# EAGLE design 7Segment_Modul (EAGLE 4.16)
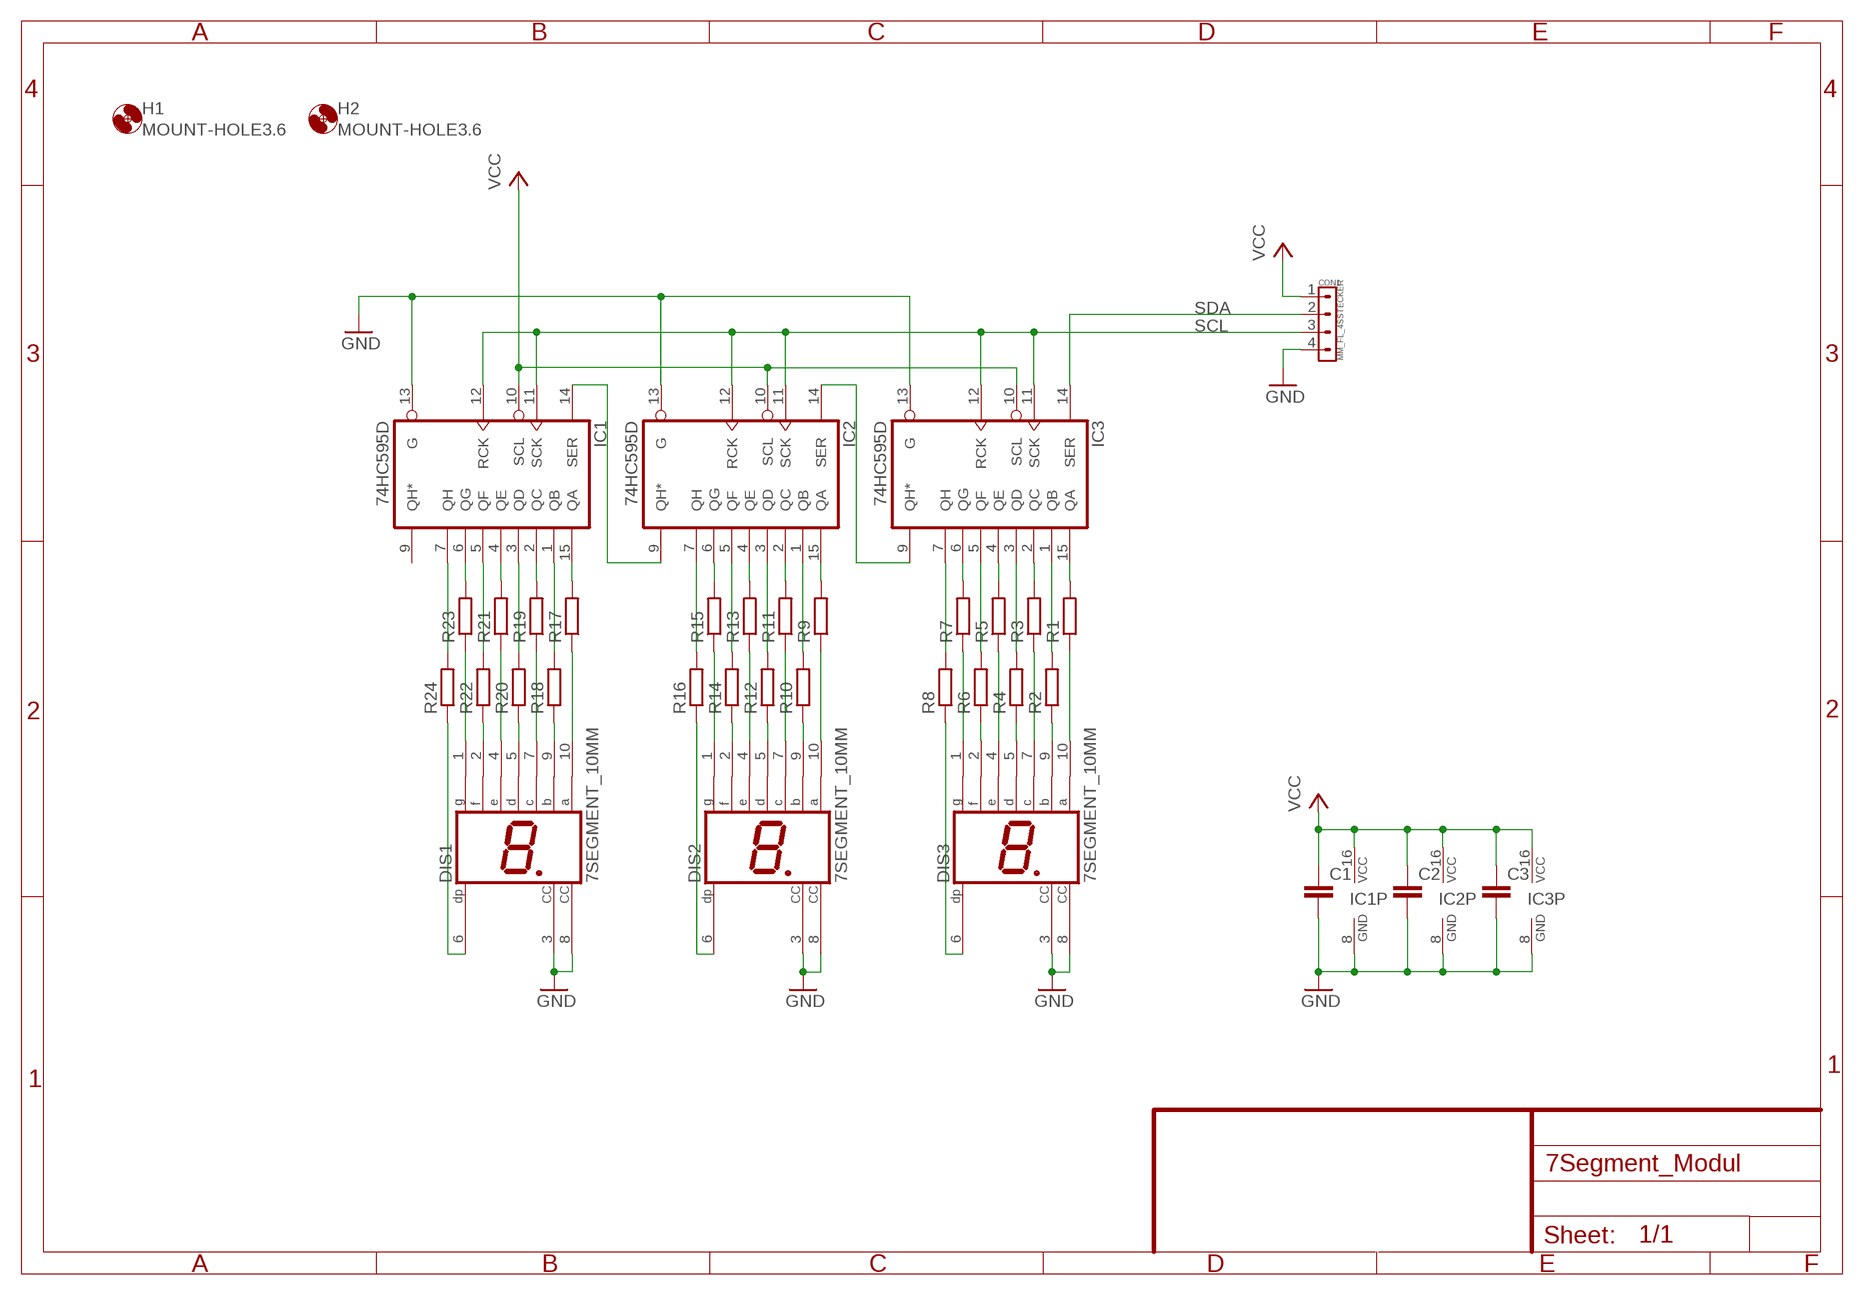
[diagram p0: schematic, sheet 1]

## Parts
C1  C-EUC0805  [C0805]
C2  C-EUC0805  [C0805]
C3  C-EUC0805  [C0805]
CON1  MM_FL_4SSTECKER  [MM_SL_4G]
DIS1  7SEGMENT_10MM  [HDSP-E]
DIS2  7SEGMENT_10MM  [HDSP-E]
DIS3  7SEGMENT_10MM  [HDSP-E]
H1  MOUNT-HOLE3.6  [3,6]
H2  MOUNT-HOLE3.6  [3,6]
IC1  74HC595D  [SO16]
IC2  74HC595D  [SO16]
IC3  74HC595D  [SO16]
R1  R-EU_R0603  [R0603]
R2  R-EU_R0603  [R0603]
R3  R-EU_R0603  [R0603]
R4  R-EU_R0603  [R0603]
R5  R-EU_R0603  [R0603]
R6  R-EU_R0603  [R0603]
R7  R-EU_R0603  [R0603]
R8  R-EU_R0603  [R0603]
R9  R-EU_R0603  [R0603]
R10  R-EU_R0603  [R0603]
R11  R-EU_R0603  [R0603]
R12  R-EU_R0603  [R0603]
R13  R-EU_R0603  [R0603]
R14  R-EU_R0603  [R0603]
R15  R-EU_R0603  [R0603]
R16  R-EU_R0603  [R0603]
R17  R-EU_R0603  [R0603]
R18  R-EU_R0603  [R0603]
R19  R-EU_R0603  [R0603]
R20  R-EU_R0603  [R0603]
R21  R-EU_R0603  [R0603]
R22  R-EU_R0603  [R0603]
R23  R-EU_R0603  [R0603]
R24  R-EU_R0603  [R0603]

## Nets
GND: C1.2 C2.2 C3.2 CON1.4 DIS1.3(CC) DIS1.8(CC) DIS2.3(CC) DIS2.8(CC) DIS3.3(CC) DIS3.8(CC) IC1.8(GND) IC1.13(G) IC2.8(GND) IC2.13(G) IC3.8(GND) IC3.13(G)
N$1: IC3.15(QA) R1.2
N$2: DIS3.10(A) R1.1
N$3: DIS3.9(B) R2.1
N$4: IC3.1(QB) R2.2
N$5: IC3.2(QC) R3.2
N$6: DIS3.7(C) R3.1
N$7: DIS3.5(D) R4.1
N$8: IC3.3(QD) R4.2
N$9: IC3.4(QE) R5.2
N$10: DIS3.4(E) R5.1
N$11: DIS3.2(F) R6.1
N$12: IC3.5(QF) R6.2
N$13: IC3.6(QG) R7.2
N$14: DIS3.1(G) R7.1
N$15: IC3.7(QH) R8.2
N$16: DIS3.6(DP) R8.1
N$17: DIS2.10(A) R9.1
N$18: IC2.15(QA) R9.2
N$19: IC2.1(QB) R10.2
N$20: DIS2.9(B) R10.1
N$21: DIS2.7(C) R11.1
N$22: IC2.2(QC) R11.2
N$23: DIS2.5(D) R12.1
N$24: IC2.3(QD) R12.2
N$25: IC2.4(QE) R13.2
N$26: DIS2.4(E) R13.1
N$27: DIS2.2(F) R14.1
N$28: IC2.5(QF) R14.2
N$29: IC2.6(QG) R15.2
N$30: DIS2.1(G) R15.1
N$31: IC2.7(QH) R16.2
N$32: DIS2.6(DP) R16.1
N$33: DIS1.10(A) R17.1
N$34: IC1.15(QA) R17.2
N$35: IC1.1(QB) R18.2
N$36: DIS1.9(B) R18.1
N$37: DIS1.7(C) R19.1
N$38: IC1.2(QC) R19.2
N$39: IC1.3(QD) R20.2
N$40: DIS1.5(D) R20.1
N$41: DIS1.4(E) R21.1
N$42: IC1.4(QE) R21.2
N$43: IC1.5(QF) R22.2
N$44: DIS1.2(F) R22.1
N$45: DIS1.1(G) R23.1
N$46: IC1.6(QG) R23.2
N$47: IC1.7(QH) R24.2
N$48: DIS1.6(DP) R24.1
N$49: IC2.14(SER) IC3.9(QH*)
N$50: IC1.14(SER) IC2.9(QH*)
SCL: CON1.3 IC1.11(SCK) IC1.12(RCK) IC2.11(SCK) IC2.12(RCK) IC3.11(SCK) IC3.12(RCK)
SDA: CON1.2 IC3.14(SER)
VCC: C1.1 C2.1 C3.1 CON1.1 IC1.10(SCL) IC1.16(VCC) IC2.10(SCL) IC2.16(VCC) IC3.10(SCL) IC3.16(VCC)
Unconnected: IC1.9(QH*)

## Library data of the parts
C1-C3 = rcl:C-EU: CAPACITOR, European symbol
CON1 = marcus:MM_FL_4S: Miniatru Print Stecker SMD 4 Kontakte Reichelt Bestellnummer: MM FL 4S Created by Marcus Knips 4/2013
DIS1-DIS3 = marcus:7SEGMENT_10MM: LED DISPLAY 1-character 7 segment, decimal point right Knigbright SA39-11, SA39-12, SC39-11, SC39-12 Device creaded by Marcus Knips 1/2012
H1 H2 = holes:MOUNT-HOLE: MOUNTING HOLE with drill center marker
IC1-IC3 = 74xx-eu:74*595: 8-bit SHIFT REGISTER, output latch
R1-R24 = rcl:R-EU_: RESISTOR, European symbol

## Board
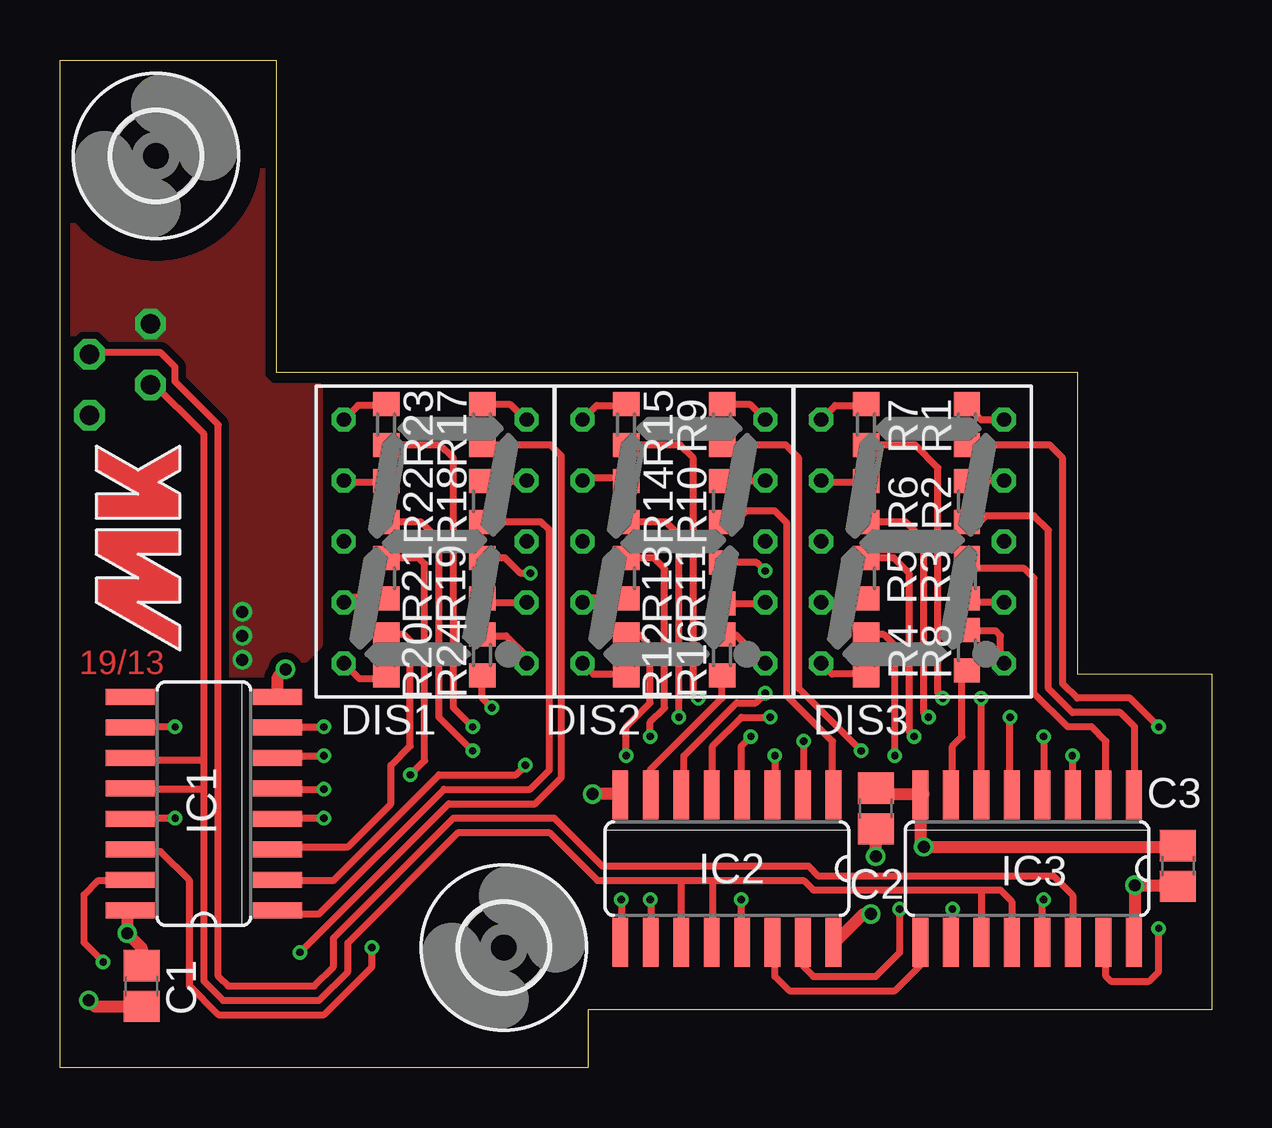
[diagram p1: board, top side]
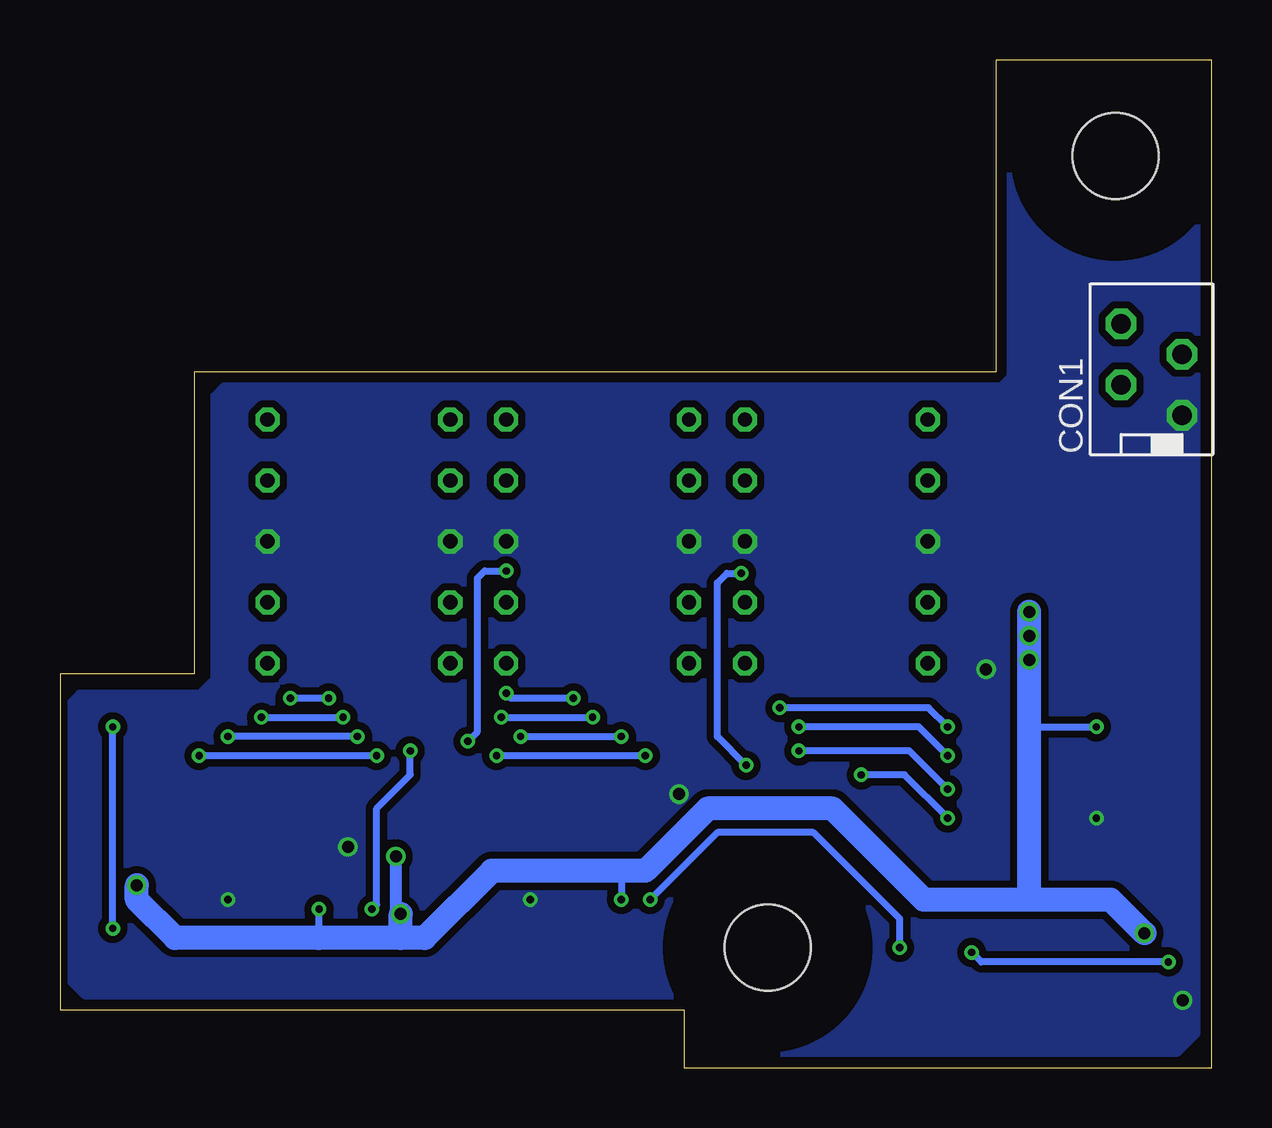
[diagram p2: board, bottom side, seen from below]

Size 48 x 42 mm. Coordinates in mm from the lower left corner, seen from the top.
Outline: 0,0 0,42 9,42 9,29 42.4,29 42.4,16.4 48,16.4 48,2.4 22,2.4 22,0 0,0
Copper layers (1*16): Top 0.035mm / dielectric 1.5mm / Bottom 0.035mm
Design rules "multi-cb_035um-cu": minimum track width 6mil, minimum drill 3mil, track to track 6mil, track to pad 6mil, pad to pad 6mil, via to via 6mil, smd to smd 6mil, copper to edge 10mil, drill to drill 8mil, minimum pad ring 8mil, minimum via ring 6mil, stop-mask expansion 3mil, vias tented up to drill 0mil, thermal gap 8mil

### Footprints (pad centres in the part's own frame; a part is rotated, then mirrored left to right if it is on the bottom)
C0805 = smd 1.3 x 1.5: 1 -0.85,0; 2 0.85,0
MM_SL_4G = drill 0.8 octagon: 1 0,1.27; 2 -1.27,-1.27; 3 -2.54,1.27; 4 -3.81,-1.27
HDSP-E = drill 0.6 octagon: 1 -3.81,5.08; 2 -3.81,2.54; 3 -3.81,0; 4 -3.81,-2.54; 5 -3.81,-5.08; 6 3.81,-5.08; 7 3.81,-2.54; 8 3.81,0; 9 3.81,2.54; 10 3.81,5.08
3,6 = hole 3.6: 0,0
SO16 = smd 0.66 x 2.032: 1 -4.445,-3.073; 2 -3.175,-3.073; 3 -1.905,-3.073; 4 -0.635,-3.073; 5 0.635,-3.073; 6 1.905,-3.073; 7 3.175,-3.073; 8 4.445,-3.073; 9 4.445,3.073; 10 3.175,3.073; 11 1.905,3.073; 12 0.635,3.073; 13 -0.635,3.073; 14 -1.905,3.073; 15 -3.175,3.073; 16 -4.445,3.073
R0603 = smd 1 x 1.1: 1 -0.85,0; 2 0.85,0

### Placement (x,y rotation side)
C1  3.4,3.4 270 top
C2  34,10.8 90 top
C3  46.6,8.4 90 top
CON1  2.5,31 90 bottom
DIS1  15.64,21.93 0 top
DIS2  25.59,21.93 0 top
DIS3  35.54,21.93 0 top
H1  4,38 0 top
H2  18.5,5 0 top
IC1  6,11 90 top
IC2  27.8,8.29 180 top
IC3  40.31,8.29 180 top
R1  37.8,26.8 270 top
R2  37.8,23.6 270 top
R3  37.8,20.4 90 top
R4  33.6,17.2 90 top
R5  33.6,20.4 90 top
R6  33.6,23.6 270 top
R7  33.6,26.8 270 top
R8  37.8,17.4 270 top
R9  27.6,26.8 270 top
R10  27.6,23.6 270 top
R11  27.6,20.2 90 top
R12  23.6,17.2 90 top
R13  23.6,20.4 90 top
R14  23.6,23.6 270 top
R15  23.6,26.8 270 top
R16  27.6,17.2 270 top
R17  17.6,26.8 270 top
R18  17.6,23.6 270 top
R19  17.6,20.4 90 top
R20  13.6,17.2 90 top
R21  13.6,20.4 90 top
R22  13.6,23.6 270 top
R23  13.6,26.8 270 top
R24  17.6,17.2 270 top
U$1  [LOGO2]  5,20.4 90 top

### Tracks (layer width: path | path; a pad name or v marks a point on that pad's centre or on a via)
GND  (via drill 0.3, 0.5)
  Top 0.3: IC2.13 28.4,5.25 v28.4,7 | IC3.13 40.95,6.95 v41,7 | IC1.13 2.96,10.4 v4.8,10.4
  Top 0.5: C3.2 46.6,9.2 v36,9.2 35.87,9.2 IC3.8 35.9,11.4 | 35.9,11.4 36,11.4 | C2.2 34.25,11.4 35.9,11.4 | IC2.8 23.32,11.4 v22.2,11.4 | IC1.8 9.07,16.27 v9.4,16.6 | C1.2 1.45,2.55 v1.2,2.8
  pour Bottom (isolate 0.3, no thermals): 0.8,41.4 7.8,41.4 8.4,40.8 8.4,28.8 8.8,28.4 41.2,28.4 41.6,28 41.6,16.2 42.2,15.6 47.2,15.6 47.6,15.2 47.6,3.6 47,3 22,3 21.4,2.4 21.4,1.2 20.8,0.6 1.4,0.6 0.6,1.4 0.6,41.2
N$1  (via drill 0.3)
  Top 0.3: 43.48,5.32 43.4,5.4 | 43.48,5.32 IC3.15 | 43.48,5.32 43.6,5.2 43.6,3.8 43.8,3.6 45.4,3.6 45.8,4 v45.8,5.8 | R1.2 41.25,25.95 41.8,25.4 41.8,16 42.4,15.4 44.6,15.4 v45.8,14.2
  Bottom 0.3: v45.8,5.8 v45.8,14.2
N$2
  Top 0.3: R1.1 37.8,27.6 38.39,27.01 DIS3.10
N$3
  Top 0.3: R2.1 37.8,24.4 37.87,24.47 DIS3.9
N$4
  Top 0.3: IC3.1 44.8,11.4 44.8,14.2 44.2,14.8 42.2,14.8 41.2,15.8 41.2,22.4 40.6,23 38.6,23 38.35,22.75 R2.2
N$5
  Top 0.3: IC3.2 43.44,11.36 43.4,11.4 43.6,11.6 43.6,13.6 43,14.2 42,14.2 40.6,15.6 40.6,20.4 40.2,20.8 38.2,20.8 37.8,21.2 R3.2
N$6
  Top 0.3: R3.1 37.95,19.35 38,19.4 38.01,19.39 DIS3.7
N$7
  Top 0.3: R4.1 33.6,16.4 32.18,16.4 DIS3.5
N$8  (via drill 0.3)
  Top 0.3: R4.2 34.35,18.05 34.8,17.6 v34.8,13 | IC3.3 42.22,11.38 42.2,11.4 v42.2,13
  Bottom 0.3: v34.8,13 v42.2,13
N$9  (via drill 0.3)
  Top 0.3: R5.2 34.75,21.25 35.4,20.6 35.4,14 v35.6,13.8 | IC3.4 40.95,11.26 41,11.2 v41,13.8
  Bottom 0.3: v35.6,13.8 v41,13.8
N$10
  Top 0.3: R5.1 33.6,19.4 DIS3.4
N$11
  Top 0.3: R6.1 33.6,24.4 31.8,24.4 DIS3.2
N$12  (via drill 0.3)
  Top 0.3: R6.2 35.25,22.75 36,22 36,14.8 v36.2,14.6 | IC3.5 39.64,11.36 39.6,11.4 v39.6,14.6
  Bottom 0.3: v39.6,14.6 v36.2,14.6
N$13  (via drill 0.3)
  Top 0.3: R7.2 35.65,25.95 36.6,25 36.6,15.6 v36.8,15.4 | IC3.6 38.41,11.39 38.4,11.4 v38.4,15.4
  Bottom 0.3: v38.4,15.4 v36.8,15.4
N$14
  Top 0.3: R7.1 33.6,27.6 32.32,27.6 DIS3.1
N$15
  Top 0.3: R8.2 37.6,16.35 37.6,13.8 37.2,13.4 37.2,11.4 37.17,11.4 IC3.7
N$16
  Top 0.3: DIS3.6 39.2,17 39.2,18 39,18.2 37.8,18.2 R8.1
N$17
  Top 0.3: DIS2.10 28.75,27.65 R9.1
N$18  (via drill 0.3)
  Top 0.3: R9.2 30.25,25.95 30.8,25.4 30.8,15.8 v33.4,13.2 | 31,5.4 30.98,5.38 IC2.15 31,5.2 31,4.2 31.4,3.8 34,3.8 35,4.8 v35,6.6
  Bottom 0.3: v33.4,13.2 33.4,12.2 34.8,10.8 34.8,6.8 v35,6.6
N$19
  Top 0.3: R10.2 28.15,22.75 28.6,23.2 29.8,23.2 30.3,22.7 30.3,15.5 32.2,13.6 32.2,11.4 32.24,11.36 IC2.1
N$20
  Top 0.3: DIS2.9 29.4,24.6 29.25,24.45 R10.1
N$21
  Top 0.3: DIS2.7 29.35,19.35 R11.1
N$22  (via drill 0.3)
  Top 0.3: R11.2 29.05,21.05 v29.4,20.7 | IC2.2 30.98,11.22 31,11.2 v31,13.6
  Bottom 0.3: v29.4,20.7 30.3,20.7 30.6,20.4 30.6,14 v31,13.6
N$23
  Top 0.3: R12.1 23.6,16.4 22.23,16.4 DIS2.5
N$24  (via drill 0.3)
  Top 0.3: R12.2 24.15,18.05 24.6,17.6 24.6,15.2 23.6,14.2 v23.6,13 | 29.6,11.2 29.6,11.26 IC2.3 29.8,11.27 | 29.8,11.27 29.8,11.2 | v29.8,13 29.8,11.27
  Bottom 0.3: v23.6,13 v29.8,13
N$25  (via drill 0.3)
  Top 0.3: R13.2 24.75,21.25 25.2,20.8 25.2,15 24.6,14.4 v24.6,13.8 | 28.4,11.4 IC2.4 28.4,11.4 | v28.8,13.8 28.4,13.4 28.4,11.4
  Bottom 0.3: v28.8,13.8 v24.6,13.8
N$26
  Top 0.3: R13.1 23.6,19.6 21.99,19.6 DIS2.4
N$27
  Top 0.3: R14.1 23.6,24.6 21.91,24.6 DIS2.2
N$28  (via drill 0.3)
  Top 0.3: R14.2 25.25,22.75 25.8,22.2 v25.8,14.6 | 27.2,11.2 27.2,11.33 IC2.5 27.16,11.23 27.2,11.2 | 27.2,11.2 27.2,11 | 27.2,11.2 27.2,13.4 28.4,14.6 v29.6,14.6
  Bottom 0.3: v29.6,14.6 v25.8,14.6
N$29  (via drill 0.3)
  Top 0.3: R15.2 25.85,25.95 26.4,25.4 26.4,15.6 v26.6,15.4 | IC2.6 25.84,11.36 25.8,11.4 26,11.6 26,13 28.2,15.2 29,15.2 v29.4,15.6
  Bottom 0.3: v26.6,15.4 29.2,15.4 v29.4,15.6
N$30
  Top 0.3: R15.1 23.55,27.6 22.37,27.6 DIS2.1
N$31
  Top 0.3: R16.2 27.6,15.4 24.6,12.4 24.6,11.6 24.62,11.57 IC2.7
N$32
  Top 0.3: DIS2.6 29.4,16.8 28.15,18.05 R16.1
N$33
  Top 0.3: DIS1.10 19.41,27.01 19.4,27 18.75,27.65 R17.1
N$34  (via drill 0.3)
  Top 0.3: R17.2 20.45,25.95 20.9,25.5 20.9,12.1 19.8,11 16.2,11 v10,4.8 | IC1.15 3.17,7.82 3.2,7.8 1.6,7.8 1,7.2 1,5.2 v1.8,4.4
  Bottom 0.3: v10,4.8 9.6,4.4 v1.8,4.4
N$35
  Top 0.3: R18.2 20.05,22.75 20.4,22.4 20.4,12.4 19.6,11.6 16,11.6 10.8,6.4 9.2,6.4 9.07,6.53 IC1.1
N$36
  Top 0.3: DIS1.9 19.45,24.45 19.4,24.4 19.35,24.45 R18.1
N$37
  Top 0.3: R19.1 17.75,19.55 17.8,19.6 18.01,19.39 DIS1.7
N$38  (via drill 0.3)
  Top 0.3: R19.2 18.55,21.25 19.2,20.6 v19.6,20.6 | v19.4,12.6 19,12.2 15.8,12.2 11.4,7.8 9,7.8 9.03,7.82 IC1.2
  Bottom 0.3: v19.6,20.6 20.2,20.6 20.6,20.2 20.6,13.8 v19.4,12.6
N$39
  Top 0.3: R20.2 14.35,18.05 14.6,17.8 14.6,13.4 13.8,12.6 13.8,11 12,9.2 9.2,9.2 9.1,9.1 IC1.3
N$40
  Top 0.3: R20.1 13.6,16.2 12.48,16.2 DIS1.5
N$41
  Top 0.3: R21.1 13.6,19.6 12.04,19.6 DIS1.4
N$42  (via drill 0.3)
  Top 0.3: R21.2 14.95,21.25 15.2,21 15.2,12.8 v14.6,12.2 | IC1.4 9.16,10.37 9.2,10.4 v11,10.4
  Bottom 0.3: v14.6,12.2 12.8,12.2 v11,10.4
N$43  (via drill 0.3)
  Top 0.3: R22.2 15.05,22.75 15.8,22 15.8,14.6 v17.2,13.2 | IC1.5 9.16,11.63 9.2,11.6 v11,11.6
  Bottom 0.3: v17.2,13.2 12.6,13.2 v11,11.6
N$44
  Top 0.3: R22.1 13.6,24.4 11.9,24.4 DIS1.2
N$45
  Top 0.3: R23.1 13.6,27.6 12.42,27.6 DIS1.1
N$46  (via drill 0.3)
  Top 0.3: R23.2 15.85,25.95 16.4,25.4 16.4,15 v17.2,14.2 | IC1.6 9.11,12.9 9.2,13 v11,13
  Bottom 0.3: v17.2,14.2 12.2,14.2 v11,13
N$47  (via drill 0.3)
  Top 0.3: R24.2 17.6,15.4 v18,15 | IC1.7 9.18,14.18 9.2,14.2 v11,14.2
  Bottom 0.3: v18,15 11.8,15 v11,14.2
N$48
  Top 0.3: DIS1.6 19.45,17.15 18.6,18 17.6,18 R24.1
N$49
  Top 0.3: IC3.9 35.87,4.26 34.8,3.2 30.4,3.2 29.8,3.8 29.8,5.2 29.72,5.2 IC2.14
N$50  (via drill 0.3)
  Top 0.3: IC2.9 23.4,5.26 v23.4,7 | v13,5 13,4.2 11,2.2 6.6,2.2 5.4,3.4 5.4,7.8 4.2,9 3,9 2.93,9.07 IC1.14
  Bottom 0.3: v23.4,7 20.6,9.8 16.6,9.8 13,6.2 v13,5
SCL
  Top 0.3: IC3.12 39.67,6.92 39.2,7.4 38.4,7.4 | IC3.11 38.41,7.39 38.4,7.4 | IC2.12 27.18,5.22 27.2,5.2 27.2,7.8 | IC1.11 2.93,12.87 3,12.8 6,12.8 | IC1.12 2.83,11.63 2.8,11.6 6,11.6 | CON1.3 3.77,28.57 3.8,28.6 6,26.4 6,12.8 | 26,7.8 22.4,7.8 20.4,9.8 16.6,9.8 12,5.2 12,4 10.8,2.8 6.8,2.8 6,3.6 6,11.6 | 26,7.8 27.2,7.8 | 27.2,7.8 31,7.8 31.4,7.4 38.4,7.4 | IC2.11 25.89,7.7 26,7.8 | 6,11.6 6,12.8
SDA
  Top 0.3: IC3.14 42.22,7.19 41.4,8 31.6,8 31.2,8.4 22.6,8.4 20.6,10.4 16.4,10.4 11.4,5.4 11.4,4.2 10.6,3.4 7,3.4 6.6,3.8 6.6,26.8 4.8,28.6 4.8,29.2 4.2,29.8 1.2,29.8 1.2,29.76 CON1.2
VCC  (via drill 0.3, 0.5)
  Top 0.3: IC2.10 24.62,6.97 v24.6,7 | IC1.10 2.95,14.2 v4.8,14.2 | IC3.10 37.2,5.28 v37.2,6.6
  Top 0.5: IC3.16 44.8,5.26 v44.8,7.6 46.6,7.6 C3.1 | v34,8.8 C2.1 | IC2.16 32.24,5.16 33.49,6.4 v33.8,6.4 | 2.96,6.55 3,6.6 | IC1.16 2.96,6.55 | 2.96,6.55 2.8,6.4 v2.8,5.6 3.4,5 C1.1
  Bottom 0.3: 24.6,8.2 v24.6,7 | 7.6,14.2 v4.8,14.2 | 37.2,5.2 37.2,5.4 v37.2,6.6
  Bottom 0.5: v33.8,6.4 34,6.6 v34,8.8
  Bottom 1: v44.8,7.6 44.8,7 43.2,5.4 37.2,5.4 33.8,5.4 | 7.6,7 12,7 15.8,10.8 21,10.8 23.6,8.2 24.6,8.2 30,8.2 32.8,5.4 33.8,5.4 | 7.6,7 4.2,7 v2.8,5.6 | 7.6,7 7.6,14.2 v7.6,17 v7.6,18 v7.6,19 | 33.8,5.4 v33.8,6.4
  pour Top (isolate 0.3, no thermals): 8.4,40.6 8.4,28.8 8.8,28.4 10.8,28.4 10.8,17.6 9.6,16.4 1.4,16.4 0.6,17.2 0.6,41.2 0.8,41.4 7.8,41.4 8.4,40.8

### Text on the board
Top: 19/13